# EAGLE design Differential_AS5048_Encoder_Schematic (EAGLE 9.6.2)
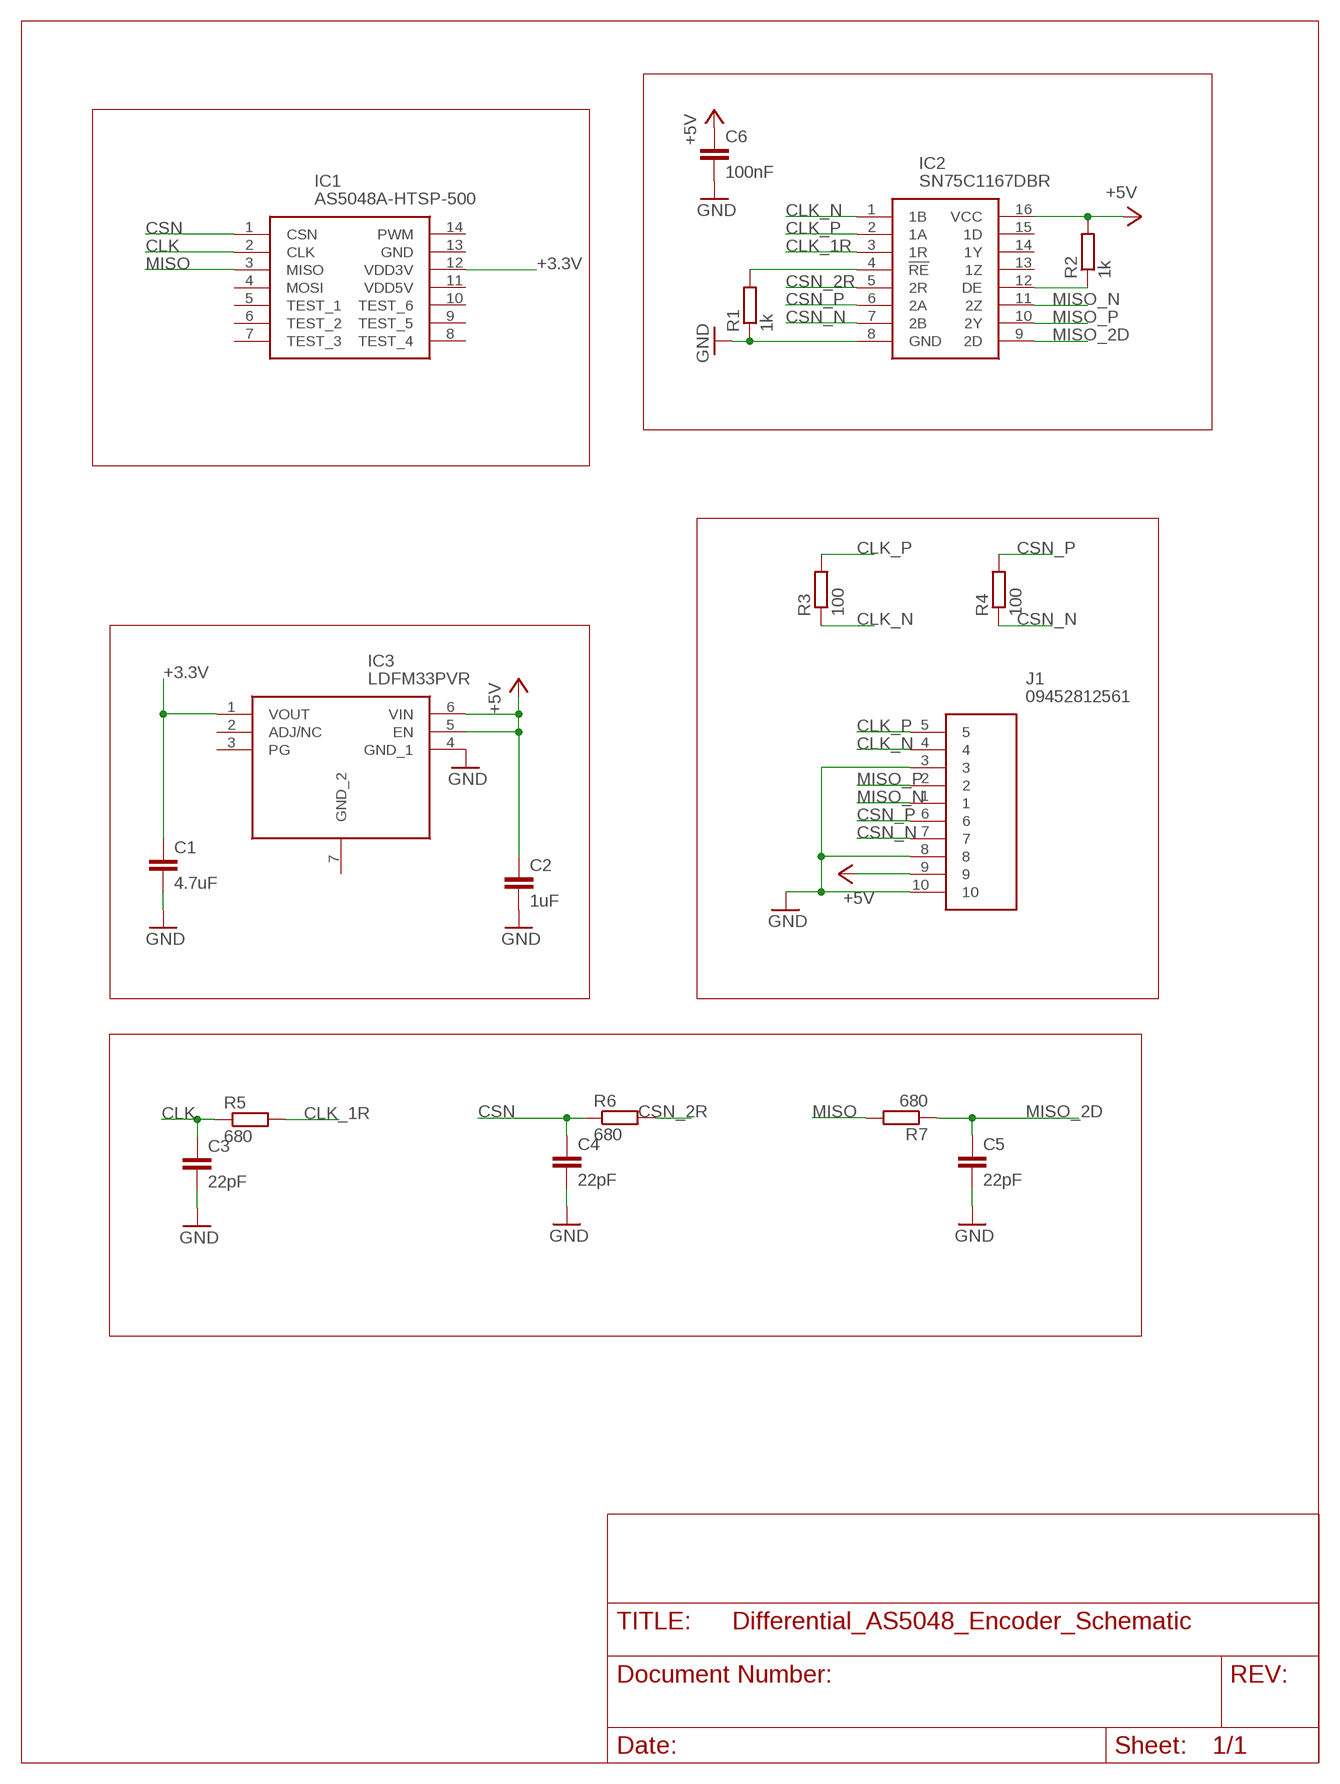
[diagram p0: schematic, sheet 1]

## Parts
C1  4.7uF  C-EUC0603  [C0603]
C2  1uF  C-EUC0603  [C0603]
C3  22pF  C-EUC0603  [C0603]
C4  22pF  C-EUC0603  [C0603]
C5  22pF  C-EUC0603  [C0603]
C6  100nF  C-EUC0603  [C0603]
IC1  AS5048A-HTSP-500  [SOP65P640X120-14N]
IC2  SN75C1167DBR  [SOP65P780X200-16N]
IC3  LDFM33PVR  [SON65P200X200X100-7N]
J1  09452812561  [09452812561]
R1  1k  R-EU_R0603  [R0603]
R2  1k  R-EU_R0603  [R0603]
R3  100  R-EU_R0603  [R0603]
R4  100  R-EU_R0603  [R0603]
R5  680  R-EU_R0603  [R0603]
R6  680  R-EU_R0603  [R0603]
R7  680  R-EU_R0603  [R0603]

## Nets
+3.3V: C1.1 IC1.12(VDD3V) IC3.1(VOUT)
+5V: C2.1 C6.1 IC2.16(VCC) IC3.5(EN) IC3.6(VIN) J1.9 R2.2
CLK: C3.1 IC1.2(CLK) R5.1
CLK_1R: IC2.3(1R) R5.2
CLK_N: IC2.1(1B) J1.4 R3.1
CLK_P: IC2.2(1A) J1.5 R3.2
CSN: C4.1 IC1.1(CSN) R6.1
CSN_2R: IC2.5(2R) R6.2
CSN_N: IC2.7(2B) J1.7 R4.1
CSN_P: IC2.6(2A) J1.6 R4.2
GND: C1.2 C2.2 C3.2 C4.2 C5.2 C6.2 IC2.8(GND) IC3.4(GND_1) J1.3 J1.8 J1.10 R1.1
MISO: IC1.3(MISO) R7.2
MISO_2D: C5.1 IC2.9(2D) R7.1
MISO_N: IC2.11(2Z) J1.1
MISO_P: IC2.10(2Y) J1.2
N$4: IC2.4(!RE) R1.2
N$8: IC2.12(DE) R2.1
Unconnected: IC1.4(MOSI) IC1.5(TEST_1) IC1.6(TEST_2) IC1.7(TEST_3) IC1.8(TEST_4) IC1.9(TEST_5) IC1.10(TEST_6) IC1.11(VDD5V) IC1.13(GND) IC1.14(PWM) IC2.13(1Z) IC2.14(1Y) IC2.15(1D) IC3.2(ADJ/NC) IC3.3(PG) IC3.7(GND_2)

## Library data of the parts
C1-C6 = rcl:C-EU: CAPACITOR, European symbol; SPICEPREFIX: C
IC1 = SamacSys_Parts:AS5048A-HTSP-500: Board Mount Hall Effect / Magnetic Sensors 14-bit rotary position sensor Source: Datasheet <http://www.mouser.com/ds/2/588/AS5048_Datasheet-263460.pdf>; ARROW_PART_NUMBER: AS5048A-HTSP-500; ARROW_PRICE-STOCK: https://www.arrow.com/en/products/as5048a-htsp-500/ams-ag; DESCRIPTION: Board Mount Hall Effect / Magnetic Sensors 14-bit rotary position sensor; HEIGHT: 1.2mm; MANUFACTURER_NAME: ams; MANUFACTURER_PART_NUMBER: AS5048A-HTSP-500; MOUSER_PART_NUMBER: 985-AS5048A-HTSP-500; MOUSER_PRICE-STOCK: https://www.mouser.co.uk/ProductDetail/ams/AS5048A-HTSP-500?qs=YVUHYZFLFLutJ5C0elRlwQ%3D%3D
IC2 = SamacSys_Parts:SN75C1167DBR: Dual Differential Drivers And Receivers Source: Datasheet <http://www.ti.com/lit/ds/symlink/sn65c1168.pdf>; ARROW_PART_NUMBER: SN75C1167DBR; ARROW_PRICE-STOCK: https://www.arrow.com/en/products/sn75c1167dbr/texas-instruments; DESCRIPTION: Dual Differential Drivers And Receivers; HEIGHT: 2mm; MANUFACTURER_NAME: Texas Instruments; MANUFACTURER_PART_NUMBER: SN75C1167DBR; MOUSER_PART_NUMBER: 595-SN75C1167DBR; MOUSER_PRICE-STOCK: https://www.mouser.co.uk/ProductDetail/Texas-Instruments/SN75C1167DBR?qs=pt%2FIv5r0EPcWpN7RZQ7l7A%3D%3D
IC3 = SamacSys_Parts:LDFM33PVR: LDO Voltage Regulators 500 mA very low drop voltage regulator Source: Datasheet <https://componentsearchengine.com/Datasheets/1/LDFM33PVR.pdf>; ARROW_PART_NUMBER: LDFM33PVR; ARROW_PRICE-STOCK: https://www.arrow.com/en/products/ldfm33pvr/stmicroelectronics; DESCRIPTION: LDO Voltage Regulators 500 mA very low drop voltage regulator; HEIGHT: 1mm; MANUFACTURER_NAME: STMicroelectronics; MANUFACTURER_PART_NUMBER: LDFM33PVR; MOUSER_PART_NUMBER: 511-LDFM33PVR; MOUSER_PRICE-STOCK: https://www.mouser.co.uk/ProductDetail/STMicroelectronics/LDFM33PVR?qs=qzCNEk%252BRr%252Bbt5RX7rWJkeQ%3D%3D
J1 = SamacSys_Parts:09452812561: Headers & Wire Housings ix Industrial 10A-1 jack V T&R450 Source: Datasheet <https://b2b.harting.com/files/download/PRD/PDF_TS/09452812561_100805702DRW000C.pdf>; ARROW_PART_NUMBER: 09452812561; ARROW_PRICE-STOCK: https://www.arrow.com/en/products/09452812561/harting; DESCRIPTION: Headers & Wire Housings ix Industrial 10A-1 jack V T&R450; HEIGHT: mm; MANUFACTURER_NAME: HARTING; MANUFACTURER_PART_NUMBER: 09452812561; MOUSER_PART_NUMBER: 617-09452812561; MOUSER_PRICE-STOCK: https://www.mouser.co.uk/ProductDetail/HARTING/09452812561?qs=T3oQrply3y9RXFJZyDv9Rw%3D%3D
R1-R7 = rcl:R-EU_: RESISTOR, European symbol; SPICEPREFIX: R

## Board
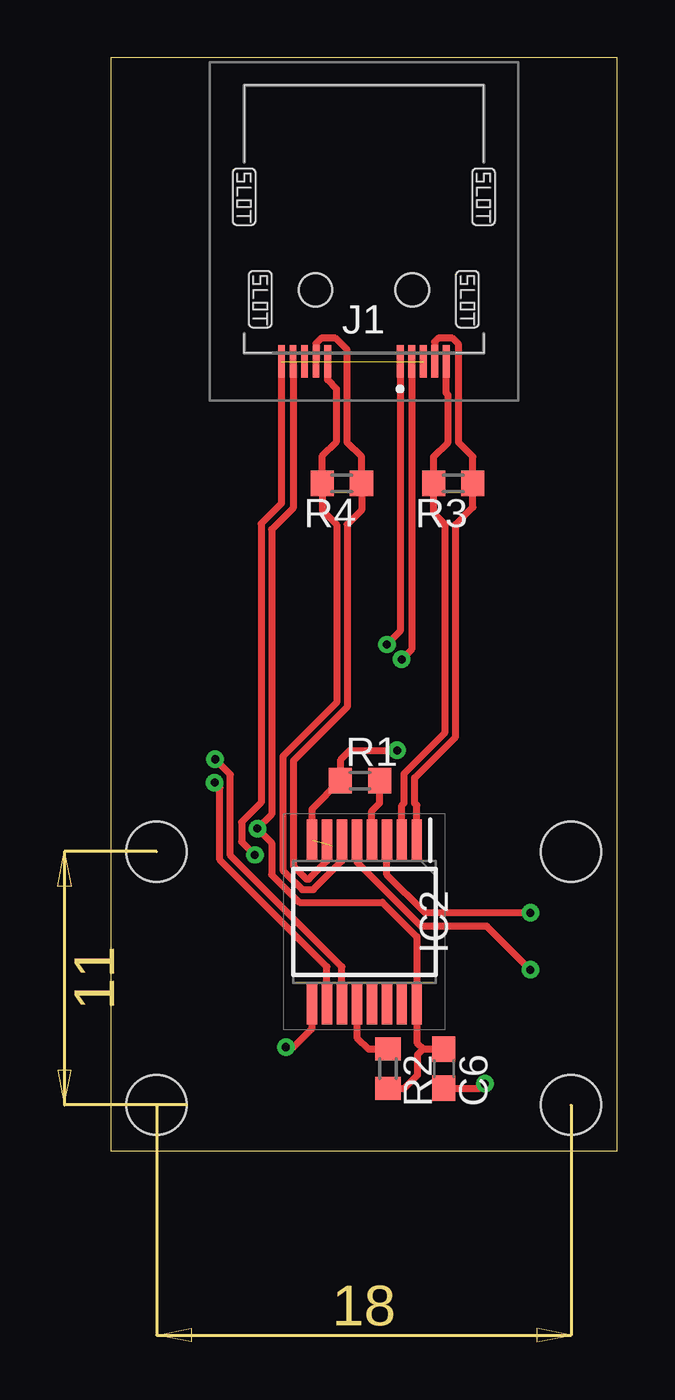
[diagram p1: board, top side]
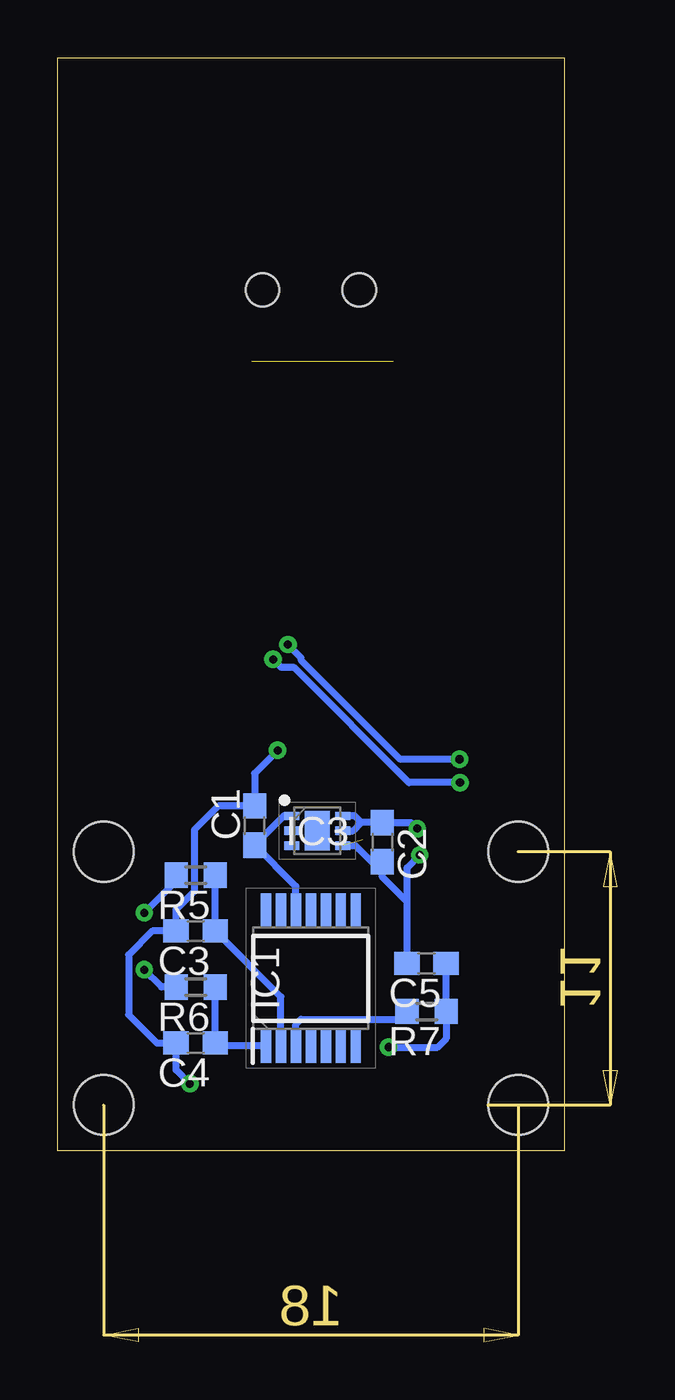
[diagram p2: board, bottom side, seen from below]

Size 22 x 47.5 mm. Coordinates in mm from the lower left corner, seen from the top.
Outline: 0,0 22,0 22,47.5 0,47.5 0,0
Copper layers (1*16): Top 0.035mm / dielectric 1.5mm / Bottom 0.035mm
Design rules "default": minimum track width 6mil, minimum drill 0.35mm, track to track 6mil, track to pad 6mil, pad to pad 6mil, via to via 6mil, smd to smd 6mil, copper to edge 40mil, drill to drill 6mil, minimum pad ring 10mil, minimum via ring 8mil, stop-mask expansion 4mil, vias tented up to drill 0mil, thermal gap 10mil
Holes 2.6 mm at 2,2 20,2 2,13 20,13

### Footprints (pad centres in the part's own frame; a part is rotated, then mirrored left to right if it is on the bottom)
C0603 = smd 1.1 x 1: 1 -0.85,0; 2 0.85,0
SOP65P640X120-14N = smd 1.475 x 0.45: 1 -2.938,1.95; 2 -2.938,1.3; 3 -2.938,0.65; 4 -2.938,0; 5 -2.938,-0.65; 6 -2.938,-1.3; 7 -2.938,-1.95; 8 2.938,-1.95; 9 2.938,-1.3; 10 2.938,-0.65; 11 2.938,0; 12 2.938,0.65; 13 2.938,1.3; 14 2.938,1.95
SOP65P780X200-16N = smd 1.8 x 0.45: 1 -3.55,2.275; 2 -3.55,1.625; 3 -3.55,0.975; 4 -3.55,0.325; 5 -3.55,-0.325; 6 -3.55,-0.975; 7 -3.55,-1.625; 8 -3.55,-2.275; 9 3.55,-2.275; 10 3.55,-1.625; 11 3.55,-0.975; 12 3.55,-0.325; 13 3.55,0.325; 14 3.55,0.975; 15 3.55,1.625; 16 3.55,2.275
SON65P200X200X100-7N = smd 0.65 x 0.35: 1 -1.1,0.65; 2 -1.1,0; 3 -1.1,-0.65; 4 1.1,-0.65; 5 1.1,0; 6 1.1,0.65 | smd 1.1 x 1.7: 7 0,0
09452812561 = smd 0.3 x 1.4: 1 -1.575,2.7; 2 -2.075,2.7; 3 -2.575,2.7; 4 -3.075,2.7; 5 -3.575,2.7; 6 1.575,2.7; 7 2.075,2.7; 8 2.575,2.7; 9 3.075,2.7; 10 3.575,2.7 | hole 1.45: -2.1,-0.4; 2.1,-0.4
R0603 = smd 1 x 1.1: 1 -0.85,0; 2 0.85,0

### Placement (x,y rotation side)
C1  13.44,14.13 90 bottom
C2  7.89,13.41 270 bottom
C3  16,9.55 180 bottom
C4  16,4.69 180 bottom
C5  5.97,8.15 180 bottom
C6  14.47,3.58 270 top
IC1  11,7.5 90 bottom
IC2  11.03,9.95 270 top
IC3  10.72,13.91 0 bottom
J1  11,37 180 top
R1  10.83,16.09 0 top
R2  12.06,3.58 270 top
R3  14.89,29 180 top
R4  10.05,29 180 top
R5  16,11.98 180 bottom
R6  16,7.12 180 bottom
R7  5.97,6.06 180 bottom

### Tracks (layer width: path | path; a pad name or v marks a point on that pad's centre or on a via)
+3.3V
  Bottom 0.305: IC3.1 12.17,14.56 C1.1 11.65,11.49 IC1.12
+5V  (via drill 0.35)
  Top 0.305: R2.2 12.76,2.73 13.34,3.3 13.34,4.19 13.57,4.43 | 13.57,4.43 C6.1 | 13.57,4.43 13.3,4.7 IC2.16 13.3,9.31 11.81,10.79 8.21,10.79 7,12 7,13.38 v6.38,14 7,14.62 7,27 7.92,27.93 J1.9
  Bottom 0.305: 8.8,14.27 C2.1 6.65,14.27 v6.38,14 | IC3.6 9.1,14.56 8.8,14.27 | IC3.5 9.16,13.91 8.8,14.27
CLK
  Bottom 0.305: R5.1 C3.1 12.3,6.7 IC1.2
CLK_1R  (via drill 0.35)
  Top 0.305: v18.23,10.34 13.66,10.34 12,12 IC2.3
  Bottom 0.305: R5.2 16.85,11.72 v18.23,10.34
CLK_N
  Top 0.305: IC2.1 13.3,15.01 13.2,15.11 13.2,16.2 14.99,17.99 14.99,27.22 15.74,27.97 R3.1 15.74,30.16 15.12,30.78 15.12,35.05 14.86,35.31 14.22,35.31 14.07,35.16 J1.4
CLK_P
  Top 0.305: IC2.2 12.65,15.01 12.75,15.11 12.75,16.39 14.53,18.18 14.53,27.22 14.04,27.71 R3.2 14.04,30.16 14.66,30.78 14.66,32.84 14.57,32.92 J1.5
CSN
  Bottom 0.305: IC1.1 15.03,4.56 C4.1 R6.1
CSN_2R  (via drill 0.35)
  Top 0.305: v18.23,7.87 16.34,9.76 13.49,9.76 10.7,12.55 IC2.5
  Bottom 0.305: R6.2 17.48,7.12 v18.23,7.87
CSN_N
  Top 0.305: IC2.7 9.4,12.6 8.62,11.81 8.51,11.81 7.94,12.38 7.94,16.95 10.28,19.28 10.28,27.22 10.9,27.84 R4.1 10.9,30.16 10.28,30.78 10.28,30.99 10.28,31 10.28,34.81 9.78,35.31 9.14,35.31 8.93,35.09 J1.7
CSN_P
  Top 0.305: 7.62,17.27 9.82,19.47 9.82,27.22 9.2,27.84 R4.2 9.2,30.2 9.82,30.82 9.82,33.1 9.43,33.5 J1.6 | 7.62,17.27 | 7.62,17.27 7.49,17.14 7.49,12.19 7.62,12.05 | 7.62,12.05 | IC2.6 10.05,12.6 8.81,11.35 8.32,11.35 7.62,12.05
GND  (via drill 0.35)  (3 unrouted)
  Top 0.305: IC2.8 8.75,14.85 R1.1 10,16.1 10,17 10.4,17.4 v12.45,17.4 | C6.2 16.06,2.73 v16.26,2.92 | J1.10 7.42,28.13 6.54,27.24 6.54,15.13 5.7,14.28 5.7,13.43 v6.27,12.86
  Bottom 0.305: IC3.4 9.07,13.26 8.37,12.56 C2.2 7.89,11.89 6.82,10.82 | C5.2 6.82,10.82 | v16.26,2.92 16.85,3.52 C4.2 17.69,4.69 18.92,5.92 18.92,8.52 17.88,9.55 C3.2 16.85,10.5 16.05,11.3 16.05,13.96 15,15 13.46,15 C1.2 13.44,16.4 v12.45,17.4 | 6.82,10.82 6.82,12.3 v6.27,12.86
MISO
  Bottom 0.305: IC1.3 11.65,5.5 11.43,5.71 7.17,5.71 R7.2
MISO_2D  (via drill 0.35)
  Top 0.305: v7.62,4.51 7.94,4.51 8.75,5.32 IC2.9
  Bottom 0.305: C5.1 R7.1 5.12,4.88 5.49,4.51 v7.62,4.51
MISO_N  (via drill 0.35)
  Top 0.305: IC2.11 10.05,8 5.21,12.84 5.21,16.35 v4.54,17.02 | v12,22 12.57,22.57 J1.1
  Bottom 0.305: v4.54,17.02 7.11,17.02 11.43,21.34 11.43,21.43 v12,22
MISO_P  (via drill 0.35)
  Top 0.305: IC2.10 9.4,8 4.75,12.65 4.75,15.77 v4.52,16 | v12.64,21.36 13.07,21.79 J1.2
  Bottom 0.305: v4.52,16 6.74,16 11.75,21.01 12.3,21.01 v12.64,21.36
N$4
  Top 0.305: IC2.4 11.35,14.78 11.68,15.11 R1.2
N$8
  Top 0.305: IC2.12 10.7,4.92 11.19,4.43 R2.1